# Altium schematic sheet Cover.SchDoc
size A3; DocumentNumber: 1; SheetNumber: 1; SheetTotal: 5
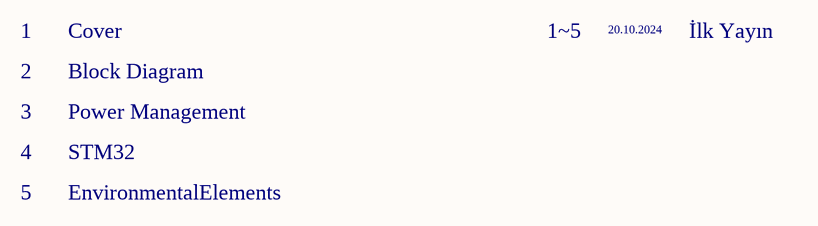
[diagram p0: Cover.SchDoc]

## Notes on the sheet
- 1
- 2
- Cover
- Block Diagram
- 1~5
- 20.10.2024
- İlk Yayın
- 3
- Power Management
- 4
- 5
- STM32
- EnvironmentalElements
- İÇİNDEKİLER / CONTENTS
- REVİZYON / REVISION
- ÜRETİM NOTLARI / PRODUCTION NOTES
- Sayfa Nu.
- Page No
- Açıklama / Description
- Tarih
- Date
- Board Features
- Kart Özellikleri
- Üretim Çıktıları
- Gerber Files
- Ekler
- Attachments
- İLETİŞİM / CONTACT
- DOSYA ADI / FILE NAME
- TANIM / DESCRIPTION
- HAZIRLAYAN / PREPARED BY
- YAYIN TARİHİ / REL. DATE
- BOYUT / SIZE
- SAYFA / SHEET
- /